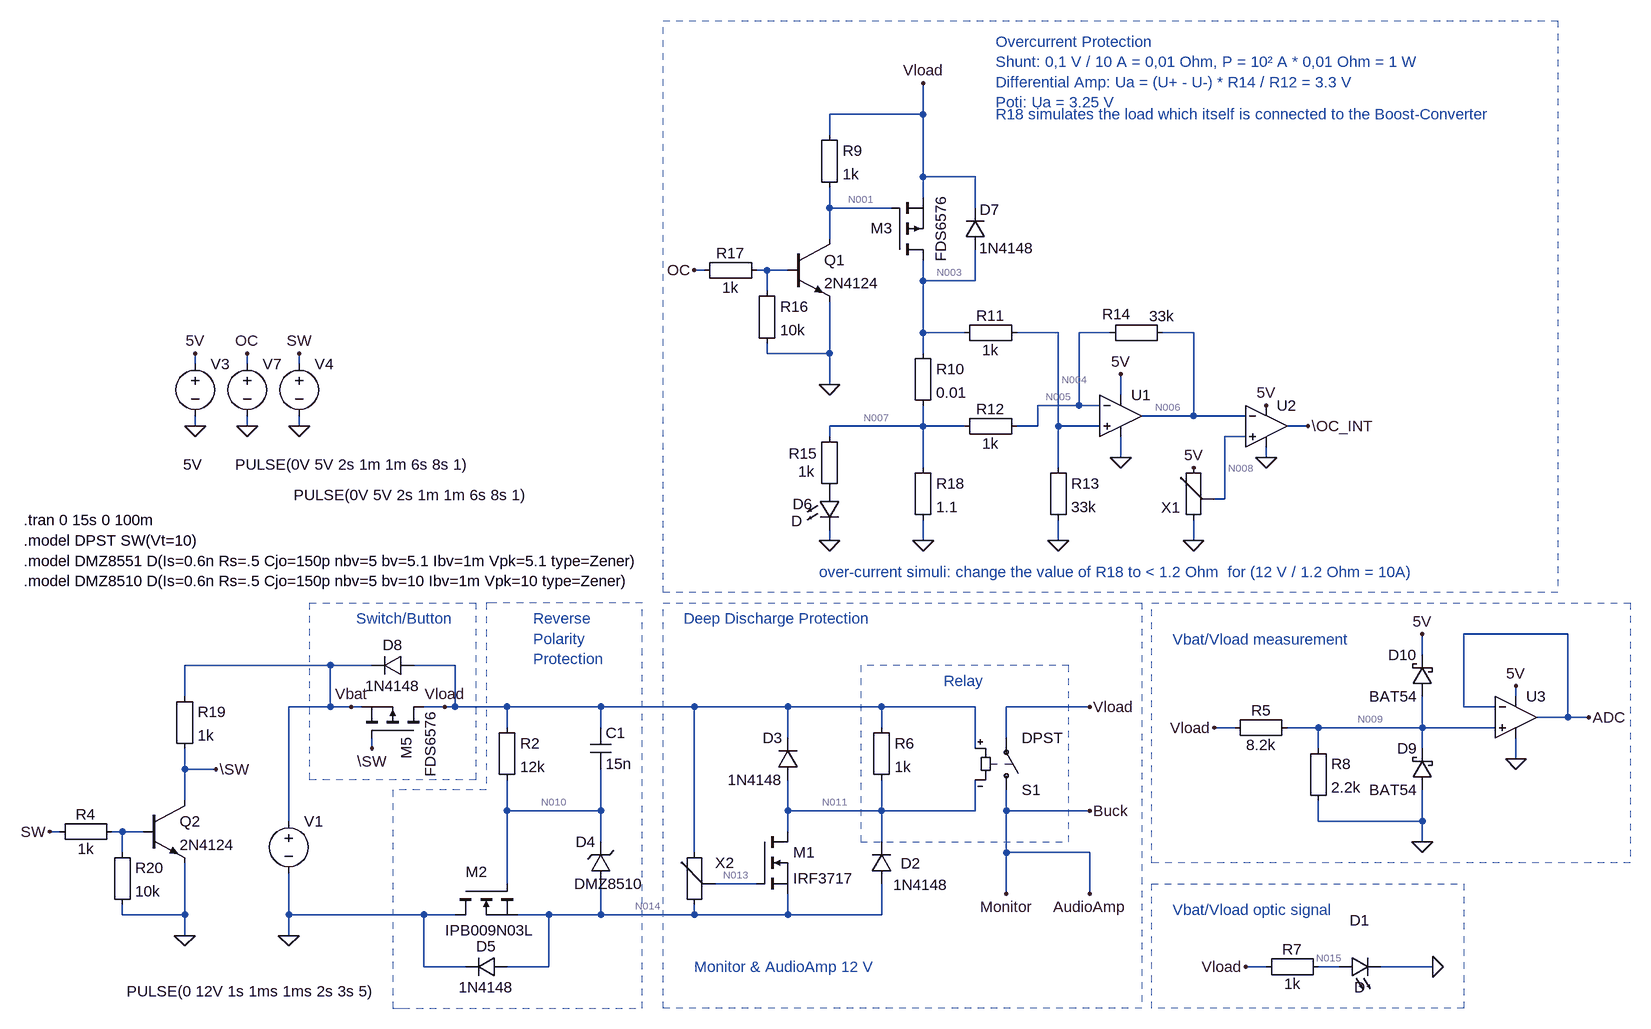
[diagram p0: schematic vin.asc]
vin.asc, the LTspice schematic file:
Version 4
SHEET 1 2260 1148
WIRE 256 -896 256 -944
WIRE 256 -896 112 -896
WIRE 112 -864 112 -896
WIRE 256 -800 256 -896
WIRE 336 -800 256 -800
WIRE 256 -768 256 -800
WIRE 112 -752 112 -784
WIRE 208 -752 112 -752
WIRE 336 -752 336 -800
WIRE 112 -704 112 -752
WIRE -80 -656 -96 -656
WIRE 16 -656 0 -656
WIRE 48 -656 16 -656
WIRE 256 -640 256 -672
WIRE 336 -640 336 -688
WIRE 336 -640 256 -640
WIRE 16 -624 16 -656
WIRE 256 -560 256 -640
WIRE 320 -560 256 -560
WIRE 464 -560 400 -560
WIRE 544 -560 496 -560
WIRE 672 -560 624 -560
WIRE 16 -528 16 -544
WIRE 112 -528 112 -608
WIRE 112 -528 16 -528
WIRE 256 -528 256 -560
WIRE -864 -512 -864 -528
WIRE -784 -512 -784 -528
WIRE -704 -512 -704 -528
WIRE 112 -480 112 -528
WIRE 560 -464 560 -496
WIRE 496 -448 496 -560
WIRE 496 -448 432 -448
WIRE 528 -448 496 -448
WIRE 672 -432 672 -560
WIRE 672 -432 592 -432
WIRE 752 -432 672 -432
WIRE -864 -416 -864 -432
WIRE -784 -416 -784 -432
WIRE -704 -416 -704 -432
WIRE 256 -416 256 -448
WIRE 256 -416 112 -416
WIRE 320 -416 256 -416
WIRE 432 -416 432 -448
WIRE 432 -416 400 -416
WIRE 464 -416 464 -560
WIRE 528 -416 464 -416
WIRE 848 -416 816 -416
WIRE 112 -400 112 -416
WIRE 752 -400 720 -400
WIRE 560 -368 560 -400
WIRE 784 -368 784 -384
WIRE 256 -352 256 -416
WIRE 464 -352 464 -416
WIRE 720 -304 720 -400
WIRE 720 -304 704 -304
WIRE 112 -240 112 -256
WIRE 256 -240 256 -272
WIRE 464 -240 464 -272
WIRE 672 -240 672 -272
WIRE 1248 -96 1088 -96
WIRE 1024 -64 1024 -96
WIRE -656 -48 -880 -48
WIRE -592 -48 -656 -48
WIRE -464 -48 -528 -48
WIRE -880 0 -880 -48
WIRE 1168 0 1168 -16
WIRE -656 16 -656 -48
WIRE -656 16 -720 16
WIRE -624 16 -656 16
WIRE -608 16 -624 16
WIRE -480 16 -512 16
WIRE -464 16 -464 -48
WIRE -464 16 -480 16
WIRE -384 16 -464 16
WIRE -240 16 -384 16
WIRE -96 16 -240 16
WIRE 48 16 -96 16
WIRE 192 16 48 16
WIRE 336 16 192 16
WIRE 512 16 384 16
WIRE 1088 16 1088 -96
WIRE 1136 16 1088 16
WIRE 1248 32 1248 -96
WIRE 1248 32 1200 32
WIRE 1280 32 1248 32
WIRE -384 48 -384 16
WIRE -240 48 -240 16
WIRE 192 48 192 16
WIRE 736 48 704 48
WIRE 864 48 816 48
WIRE 1024 48 1024 0
WIRE 1024 48 864 48
WIRE 1136 48 1024 48
WIRE 48 64 48 16
WIRE 384 64 384 16
WIRE -592 80 -592 64
WIRE 336 80 336 16
WIRE 864 80 864 48
WIRE 1024 80 1024 48
WIRE 1168 96 1168 64
WIRE -880 112 -880 80
WIRE -832 112 -880 112
WIRE -880 160 -880 112
WIRE -384 176 -384 128
WIRE -240 176 -240 112
WIRE -240 176 -384 176
WIRE 48 176 48 128
WIRE 192 176 192 128
WIRE 192 176 48 176
WIRE 336 176 336 128
WIRE 336 176 192 176
WIRE 384 176 384 144
WIRE 512 176 384 176
WIRE -720 192 -720 16
WIRE 864 192 864 160
WIRE 1024 192 1024 144
WIRE 1024 192 864 192
WIRE -1072 208 -1088 208
WIRE -976 208 -992 208
WIRE -944 208 -976 208
WIRE 48 208 48 176
WIRE -240 224 -240 176
WIRE 192 224 192 176
WIRE 1024 224 1024 192
WIRE -976 240 -976 208
WIRE -96 240 -96 16
WIRE 384 240 384 176
WIRE 512 240 384 240
WIRE -384 288 -384 176
WIRE 0 288 -64 288
WIRE 384 304 384 240
WIRE 512 304 512 240
WIRE -976 336 -976 320
WIRE -880 336 -880 256
WIRE -880 336 -976 336
WIRE -720 336 -720 272
WIRE -512 336 -720 336
WIRE -464 336 -512 336
WIRE -320 336 -368 336
WIRE -240 336 -240 288
WIRE -240 336 -320 336
WIRE -96 336 -96 320
WIRE -96 336 -240 336
WIRE 48 336 48 304
WIRE 48 336 -96 336
WIRE 192 336 192 288
WIRE 192 336 48 336
WIRE -880 368 -880 336
WIRE -720 368 -720 336
WIRE -512 416 -512 336
WIRE -448 416 -512 416
WIRE -320 416 -320 336
WIRE -320 416 -384 416
WIRE 784 416 752 416
WIRE 896 416 864 416
WIRE 1040 416 960 416
FLAG 1040 416 0
FLAG -624 16 Vbat
FLAG -480 16 Vload
FLAG 752 416 Vload
FLAG 704 48 Vload
FLAG 1280 32 ADC
FLAG 512 16 Vload
FLAG 512 176 Buck
FLAG -704 -416 0
FLAG -704 -528 SW
FLAG 464 -240 0
FLAG 560 -368 0
FLAG 256 -240 0
FLAG -784 -416 0
FLAG -784 -528 OC
FLAG 256 -944 Vload
FLAG 112 -240 0
FLAG 560 -496 5V
FLAG 784 -448 5V
FLAG 784 -368 0
FLAG 672 -240 0
FLAG 672 -352 5V
FLAG 848 -416 \OC_INT
FLAG 112 -480 0
FLAG -96 -656 OC
FLAG -720 368 0
FLAG -592 80 \SW
FLAG -880 368 0
FLAG -1088 208 SW
FLAG -832 112 \SW
FLAG 384 304 Monitor
FLAG 512 304 AudioAmp
FLAG -864 -416 0
FLAG -864 -528 5V
FLAG 1168 96 0
FLAG 1168 -16 5V
FLAG 1024 -96 5V
FLAG 1024 224 0
SYMBOL sw 384 160 M180
SYMATTR InstName S1
SYMATTR Value DPST
SYMBOL Misc\\EuropeanResistor 768 432 R270
WINDOW 0 27 56 VTop 2
WINDOW 3 5 56 VBottom 2
SYMATTR InstName R7
SYMATTR Value 1k
SYMBOL LED 896 432 R270
WINDOW 0 72 32 VTop 2
WINDOW 3 0 32 VBottom 2
SYMATTR InstName D1
SYMBOL nmos 0 208 R0
SYMATTR InstName M1
SYMATTR Value IRF3717
SYMBOL diode 208 288 R180
WINDOW 0 -44 31 Left 2
WINDOW 3 -87 -2 Left 2
SYMATTR InstName D2
SYMATTR Value 1N4148
SYMATTR Description Schottky diode
SYMATTR Type schottky
SYMBOL diode 64 128 R180
WINDOW 0 24 64 Left 2
WINDOW 3 24 0 Left 2
SYMATTR InstName D3
SYMATTR Value 1N4148
SYMBOL pot -112 224 R0
SYMATTR InstName X2
SYMATTR SpiceLine R=10k Val=72.5
SYMBOL Misc\\EuropeanResistor 176 32 R0
SYMATTR InstName R6
SYMATTR Value 1k
SYMBOL voltage -720 176 R0
WINDOW 123 0 0 Left 2
WINDOW 39 0 0 Left 2
WINDOW 3 -249 278 Left 2
SYMATTR Value PULSE(0 12V 1s 1ms 1ms 2s 3s 5)
SYMATTR InstName V1
SYMBOL nmos -464 288 M90
WINDOW 0 -18 50 VLeft 2
WINDOW 3 72 121 VLeft 2
SYMATTR InstName M2
SYMATTR Value IPB009N03L
SYMBOL Misc\\EuropeanResistor -400 32 R0
SYMATTR InstName R2
SYMATTR Value 12k
SYMBOL zener -224 288 R180
WINDOW 0 24 64 Left 2
WINDOW 3 -50 0 Left 2
SYMATTR InstName D4
SYMATTR Value DMZ8510
SYMBOL cap -256 48 R0
SYMATTR InstName C1
SYMATTR Value 15n
SYMATTR SpiceLine V=50V
SYMBOL Misc\\EuropeanResistor 720 64 R270
WINDOW 0 27 56 VTop 2
WINDOW 3 5 56 VBottom 2
SYMATTR InstName R5
SYMATTR Value 8.2k
SYMBOL Misc\\EuropeanResistor 848 64 R0
SYMATTR InstName R8
SYMATTR Value 2.2k
SYMBOL schottky 1040 144 R180
WINDOW 0 24 64 Left 2
WINDOW 3 24 0 Left 2
SYMATTR InstName D9
SYMATTR Value BAT54
SYMATTR Description Zener Diode
SYMATTR Type zener
SYMBOL diode -384 400 R90
WINDOW 0 0 32 VBottom 2
WINDOW 3 32 32 VTop 2
SYMATTR InstName D5
SYMATTR Value 1N4148
SYMATTR Description Schottky diode
SYMATTR Type schottky
SYMBOL voltage -704 -528 R0
WINDOW 123 0 0 Left 2
WINDOW 39 0 0 Left 2
WINDOW 3 -8 218 Left 2
SYMATTR Value PULSE(0V 5V 2s 1m 1m 6s 8s 1)
SYMATTR InstName V4
SYMBOL Misc\\EuropeanResistor 240 -544 R0
SYMATTR InstName R10
SYMATTR Value 0.01
SYMBOL Misc\\EuropeanResistor 304 -544 R270
WINDOW 0 27 56 VTop 2
WINDOW 3 5 56 VBottom 2
SYMATTR InstName R11
SYMATTR Value 1k
SYMBOL Misc\\EuropeanResistor 304 -400 R270
WINDOW 0 27 56 VTop 2
WINDOW 3 5 56 VBottom 2
SYMATTR InstName R12
SYMATTR Value 1k
SYMBOL Misc\\EuropeanResistor 448 -368 R0
SYMATTR InstName R13
SYMATTR Value 33k
SYMBOL Misc\\EuropeanResistor 528 -544 R270
WINDOW 0 29 26 VTop 2
WINDOW 3 57 95 VBottom 2
SYMATTR InstName R14
SYMATTR Value 33k
SYMBOL voltage -784 -528 R0
WINDOW 123 0 0 Left 2
WINDOW 39 0 0 Left 2
WINDOW 3 -18 171 Left 2
SYMATTR Value PULSE(0V 5V 2s 1m 1m 6s 8s 1)
SYMATTR InstName V7
SYMBOL Misc\\EuropeanResistor 96 -416 R0
WINDOW 0 -47 42 Left 2
WINDOW 3 -32 70 Left 2
SYMATTR InstName R15
SYMATTR Value 1k
SYMBOL LED 96 -320 R0
WINDOW 0 -41 24 Left 2
WINDOW 3 -43 50 Left 2
SYMATTR InstName D6
SYMBOL Opamps\\UniversalOpamp2 560 -432 R0
SYMATTR InstName U1
SYMBOL Opamps\\UniversalOpamp2 784 -416 R0
SYMATTR InstName U2
SYMBOL pot 656 -368 R0
WINDOW 0 -34 77 Left 2
SYMATTR InstName X1
SYMATTR SpiceLine R=10k Val=35
SYMBOL Misc\\EuropeanResistor 16 -672 R90
WINDOW 0 5 56 VBottom 2
WINDOW 3 27 56 VTop 2
SYMATTR InstName R17
SYMATTR Value 1k
SYMBOL diode 352 -688 R180
WINDOW 0 -22 61 Left 2
WINDOW 3 -75 2 Left 2
SYMATTR InstName D7
SYMATTR Value 1N4148
SYMATTR Description Schottky diode
SYMATTR Type schottky
SYMBOL Misc\\EuropeanResistor 96 -880 R0
SYMATTR InstName R9
SYMATTR Value 1k
SYMBOL pmos 208 -672 M180
WINDOW 0 -33 49 Left 2
WINDOW 3 75 -3 VRight 2
SYMATTR InstName M3
SYMATTR Value FDS6576
SYMBOL npn 48 -704 R0
SYMATTR InstName Q1
SYMATTR Value 2N4124
SYMBOL Misc\\EuropeanResistor 0 -640 R0
SYMATTR InstName R16
SYMATTR Value 10k
SYMBOL Misc\\EuropeanResistor 240 -368 R0
SYMATTR InstName R18
SYMATTR Value 1.1
SYMBOL pmos -512 64 M270
WINDOW 0 -33 27 Left 2
WINDOW 3 -60 -10 Left 2
SYMATTR InstName M5
SYMATTR Value FDS6576
SYMBOL Misc\\EuropeanResistor -976 192 R90
WINDOW 0 5 56 VBottom 2
WINDOW 3 27 56 VTop 2
SYMATTR InstName R4
SYMATTR Value 1k
SYMBOL Misc\\EuropeanResistor -896 -16 R0
SYMATTR InstName R19
SYMATTR Value 1k
SYMBOL npn -944 160 R0
SYMATTR InstName Q2
SYMATTR Value 2N4124
SYMBOL Misc\\EuropeanResistor -992 224 R0
SYMATTR InstName R20
SYMATTR Value 10k
SYMBOL diode -528 -64 R90
WINDOW 0 0 32 VBottom 2
WINDOW 3 32 32 VTop 2
SYMATTR InstName D8
SYMATTR Value 1N4148
SYMATTR Description Schottky diode
SYMATTR Type schottky
SYMBOL voltage -864 -528 R0
WINDOW 123 0 0 Left 2
WINDOW 39 0 0 Left 2
WINDOW 3 -18 171 Left 2
SYMATTR Value 5V
SYMATTR InstName V3
SYMBOL Opamps\\UniversalOpamp2 1168 32 R0
SYMATTR InstName U3
SYMBOL schottky 1040 0 R180
WINDOW 0 24 64 Left 2
WINDOW 3 24 0 Left 2
SYMATTR InstName D10
SYMATTR Value BAT54
SYMATTR Description Zener Diode
SYMATTR Type zener
TEXT -1128 -272 Left 2 !.tran 0 15s 0 100m
TEXT -1128 -240 Left 2 !.model DPST SW(Vt=10)\n.model DMZ8551 D(Is=0.6n Rs=.5 Cjo=150p nbv=5 bv=5.1 Ibv=1m Vpk=5.1 type=Zener)\n.model DMZ8510 D(Is=0.6n Rs=.5 Cjo=150p nbv=5 bv=10 Ibv=1m Vpk=10 type=Zener)
TEXT 368 -1008 Left 2 ;Overcurrent Protection\nShunt: 0,1 V / 10 A = 0,01 Ohm, P = 10² A * 0,01 Ohm = 1 W\nDifferential Amp: Ua = (U+ - U-) * R14 / R12 = 3.3 V\nPoti: Ua = 3.25 V
TEXT 96 -192 Left 2 ;over-current simuli: change the value of R18 to < 1.2 Ohm  for (12 V / 1.2 Ohm = 10A)
TEXT 288 -24 Left 2 ;Relay
TEXT -616 -120 Left 2 ;Switch/Button
TEXT -344 -120 Left 2 ;Reverse\nPolarity\nProtection
TEXT 640 328 Left 2 ;Vbat/Vload optic signal
TEXT 640 -88 Left 2 ;Vbat/Vload measurement
TEXT -112 -120 Left 2 ;Deep Discharge Protection
TEXT 368 -896 Left 2 ;R18 simulates the load which itself is connected to the Boost-Converter
TEXT -96 416 Left 2 ;Monitor & AudioAmp 12 V
LINE Normal -176 -144 -400 -144 1
LINE Normal -176 480 -176 -144 1
LINE Normal -544 480 -176 480 1
LINE Normal -560 480 -544 480 1
LINE Normal -560 144 -560 480 1
LINE Normal -416 144 -560 144 1
LINE Normal -416 -144 -416 144 1
LINE Normal -400 -144 -416 -144 1
RECTANGLE Normal 1344 256 608 -144 1
RECTANGLE Normal 1232 -160 -144 -1040 1
RECTANGLE Normal 160 224 480 -48 1
RECTANGLE Normal -432 128 -688 -144 1
RECTANGLE Normal 1088 480 608 288 1
RECTANGLE Normal 592 480 -144 -144 1

The netlist it stands for:
* vin.asc
S1 AudioAmp Vload Vload N011 DPST
R7 Vload N015 1k
D1 N015 0 D
M1 N011 N013 N014 N014 IRF3717
D2 N014 N011 1N4148
D3 N011 Vload 1N4148
XX2 Vload N013 N014 pot R=10k Val=72.5  ; pins 1 2 3
R6 Vload N011 1k
V1 Vbat 0 PULSE(0 12V 1s 1ms 1ms 2s 3s 5)
M2 0 N010 N014 N014 IPB009N03L
R2 Vload N010 12k
D4 N014 N010 DMZ8510
C1 Vload N010 15n V=50V
R5 Vload N009 8.2k
R8 N009 0 2.2k
D9 0 N009 BAT54
D5 N014 0 1N4148
V4 SW 0 PULSE(0V 5V 2s 1m 1m 6s 8s 1)
R10 N003 N007 0.01
R11 N003 N004 1k
R12 N007 N005 1k
R13 N004 0 33k
R14 N005 N006 33k
V7 OC 0 PULSE(0V 5V 2s 1m 1m 6s 8s 1)
R15 N007 P001 1k
D6 P001 0 D
XU1 N004 N005 5V 0 N006 level.2 Avol=1Meg GBW=10Meg Slew=10Meg ilimit=25m rail=0 Vos=0 phimargin=45 en=0 enk=0 in=0 ink=0 Rin=500Meg  ; pins IN+ IN- V+ V- OUT
XU2 N008 N006 5V 0 \OC_INT level.2 Avol=1Meg GBW=10Meg Slew=10Meg ilimit=25m rail=0 Vos=0 phimargin=45 en=0 enk=0 in=0 ink=0 Rin=500Meg  ; pins IN+ IN- V+ V- OUT
XX1 5V N008 0 pot R=10k Val=35  ; pins 1 2 3
R17 N002 OC 1k
D7 N003 Vload 1N4148
R9 Vload N001 1k
M3 N003 N001 Vload Vload FDS6576
Q1 N001 N002 0 0 2N4124
R16 N002 0 10k
R18 N007 0 1.1
M5 Vload \SW Vbat Vbat FDS6576
R4 N012 SW 1k
R19 Vbat \SW 1k
Q2 \SW N012 0 0 2N4124
R20 N012 0 10k
D8 Vload Vbat 1N4148
V3 5V 0 5V
XU3 N009 ADC 5V 0 ADC level.2 Avol=1Meg GBW=10Meg Slew=10Meg ilimit=25m rail=0 Vos=0 phimargin=45 en=0 enk=0 in=0 ink=0 Rin=500Meg  ; pins IN+ IN- V+ V- OUT
D10 N009 5V BAT54
.model D D
.lib standard.dio
.model NPN NPN
.model PNP PNP
.lib standard.bjt
.model NMOS NMOS
.model PMOS PMOS
.lib standard.mos
.tran 0 15s 0 100m
.model DPST SW(Vt=10)
.model DMZ8551 D(Is=0.6n Rs=.5 Cjo=150p nbv=5 bv=5.1 Ibv=1m Vpk=5.1 type=Zener)
.model DMZ8510 D(Is=0.6n Rs=.5 Cjo=150p nbv=5 bv=10 Ibv=1m Vpk=10 type=Zener)
* Overcurrent Protection
* Shunt: 0,1 V / 10 A = 0,01 Ohm, P = 10² A * 0,01 Ohm = 1 W
* Differential Amp: Ua = (U+ - U-) * R14 / R12 = 3.3 V
* Poti: Ua = 3.25 V
* over-current simuli: change the value of R18 to < 1.2 Ohm  for (12 V / 1.2 Ohm = 10A)
* Relay
* Switch/Button
* Reverse
* Polarity
* Protection
* Vbat/Vload optic signal
* Vbat/Vload measurement
* Deep Discharge Protection
* R18 simulates the load which itself is connected to the Boost-Converter
* Monitor & AudioAmp 12 V
.lib UniversalOpamps2.sub
.backanno
.end

* Results of the author's LTspice run, read from the files saved beside the schematic
* Operating Point, zero values left out:
*   V(audioamp) = 211.1 µV
*   V(vload) = 211.1 µV
*   V(n011) = 211.1 µV
*   V(n015) = 211.1 µV
*   V(n013) = 211 µV
*   V(n014) = 211 µV
*   V(n010) = 211.1 µV
*   V(n009) = 225.3 µV
*   V(n003) = 1.083 µV
*   V(n007) = 1.083 µV
*   V(n004) = 5.905 µV
*   V(n005) = 980.3 µV
*   V(n006) = 33.13 mV
*   V(p001) = 1.083 µV
*   V(5v) = 5 V
*   V(\oc_int) = 5 V
*   V(n008) = 3.25 V
*   V(n001) = 211.1 µV
*   V(adc) = 3.555 mV
*   Id(M5) = 849.3 pA
*   Is(M5) = -849.3 pA
*   Id(M3) = -845.7 pA
*   Is(M3) = 845.7 pA
*   Id(M2) = -1.12 pA
*   Is(M2) = 1.12 pA
*   I(D10) = -100 nA
*   I(D9) = -867.2 pA
*   I(D8) = 11.77 pA
*   I(D7) = -11.65 pA
*   I(D5) = 11.76 pA
*   I(R18) = 984.9 nA
*   I(R14) = -974.3 nA
*   I(R13) = 178.9 pA
*   I(R12) = -979.2 nA
*   I(R11) = -4.821 nA
*   I(R10) = 5.678 nA
*   I(R8) = 102.4 nA
*   I(R5) = -1.731 nA
*   I(V3) = -555.1 µA
*   I(V1) = 861.1 pA
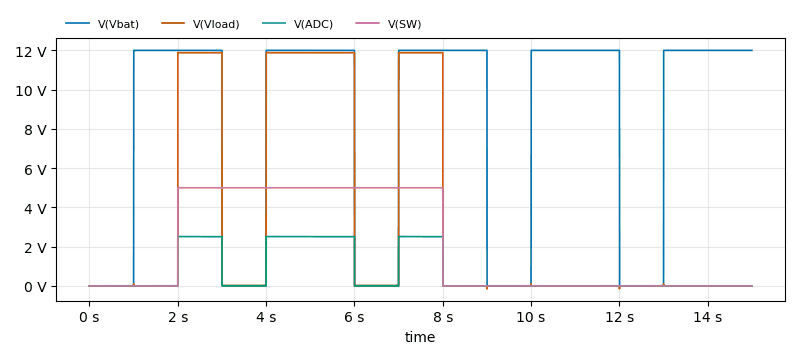
[diagram p1: Transient Analysis of vin.asc, plotted from the saved traces]
* Transient Analysis, 1 run:
*   V(Vbat): min 0 V, max 12 V, average 8.003 V, rms 9.799 V, last 12 V
*   V(Vload): min -146.7 mV, max 11.88 V, average 3.175 V, rms 6.139 V, last 256.2 µV
*   V(ADC): min 12.73 µV, max 2.514 V, average 674.1 mV, rms 1.299 V, last 3.563 mV
*   V(SW): min 0 V, max 5 V, average 2 V, rms 3.162 V, last 0 V